# Altium schematic sheet DB10005_CAN.SchDoc: CAN interface
size A4; SheetNumber: 6; SheetTotal: 7
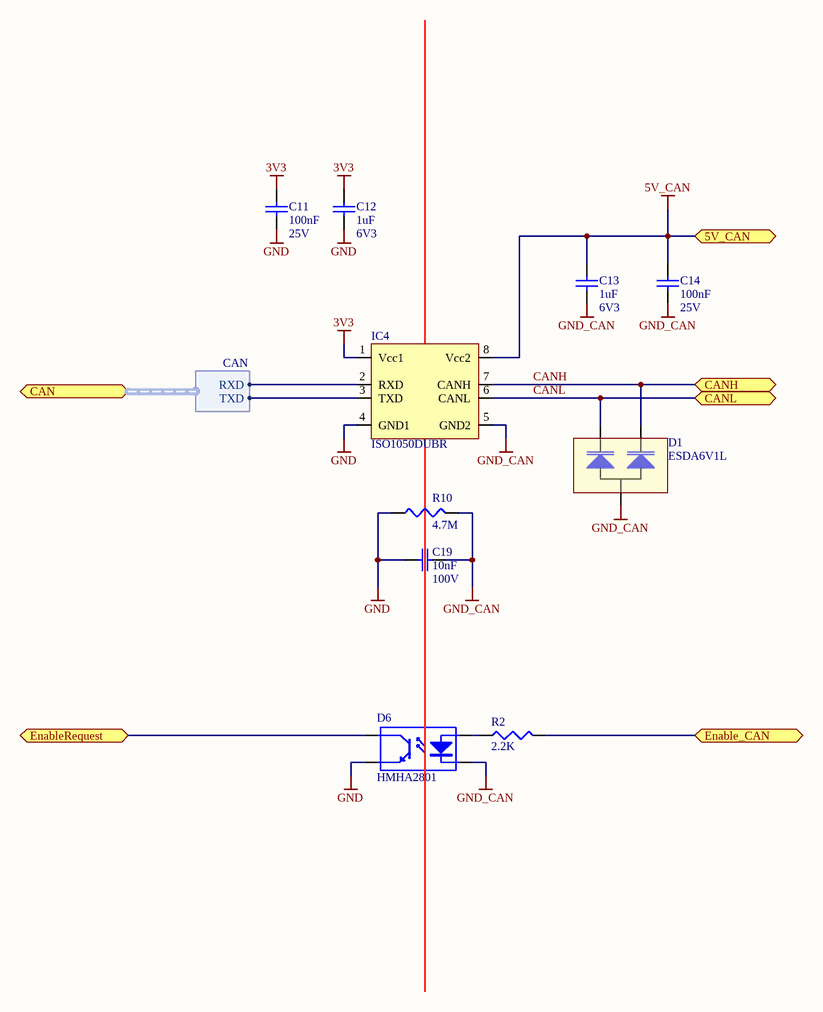
[diagram p0: DB10005_CAN.SchDoc]

## Parts
C11  100nF  Voltage Rating: 25V  [C0402]
C12  1uF  Voltage Rating: 6V3  [C0402]
C13  1uF  Voltage Rating: 6V3  [C0402]
C14  100nF  Voltage Rating: 25V  [C0402]
C19  10nF  Voltage Rating: 100V  [C-0805]
D1  ESDA6V1L  [SOT23]
D6  HMHA2801  [FSOP4]
IC4  ISO1050DUBR  [PDSO8]
R2  2.2K  [0603]
R10  4.7M  [0805]

## Ports
5V_CAN, CAN (harness CAN), CANH, CANL, Enable_CAN, EnableRequest

## Harnesses
CAN: RXD, TXD

## Nets
3V3: C11.2 C12.2 IC4.1(Vcc1)
5V_CAN: C13.2 C14.2 IC4.8(Vcc2) ; port 5V_CAN
GND: C11.1 C12.1 C19.1 D6.3(E1) IC4.4(GND1) R10.1
GND_CAN: C13.1 C14.1 C19.2 D1.A D6.2(K1) IC4.5(GND2) R10.2
CANH: D1.K1 IC4.7(CANH) ; port CANH
CANL: D1.K2 IC4.6(CANL) ; port CANL
Enable_CAN: R2.2 ; port Enable_CAN
EnableRequest: D6.4(C1) ; port EnableRequest
NetD6_1: D6.1(A1) R2.1
NetIC4_2: IC4.2(RXD) ; port CAN.RXD
NetIC4_3: IC4.3(TXD) ; port CAN.TXD

## Notes on the sheet
- Title
- Size:
- Date:
- A4
- Number:
- Time:
- Revision:
- Sheet
- of
- File:

## Library data of the parts
C11 C14 = 100nF/0402/CER/25V: Capacitor, 100nF, 25V, X7R; Capacitance Tolerance: 10nF; Capacitor Case Style: 0402; Brand Number: GRM155R71E104KE14D; Brand: MULTICOMP; Dielectric Characteristic: X7R; Capacitance: 100nF; Temperature Range: -55 to +125 C; Price: 0,0225; Order Code Supplier: 2456106; Supplier: Farnell
C12 C13 = 1uF/0402/CER/6.3V: Capacitor, 1uF, 6.3V, X5R; Capacitance Tolerance: ± 10%; Capacitor Case Style: 0402; Brand Number: 04026D105KAT2A; Brand: AVX; Dielectric Characteristic: X5R; Capacitance: 1uF; Temperature Range: -55°C to +85°C; Price: 0,0874; Order Code Supplier: 1327658; Supplier: Farnell
C19 = 10nF/0805/CER/100V: Capacitor, 10nF, 100V, X7R; Capacitance Tolerance: ± 10%; Capacitor Case Style: 0805; Brand Number: 08051C103KAZ2A; Brand: AVX; Dielectric Characteristic: X7R; Capacitance: 10nF; Temperature Range: -55°C to +125°C; Price: 0,131; Order Code Supplier: 1301898; Supplier: Farnell
D1 = ESDA6V1L: Diode TVS Dual, Vrwm: 5.25V, Vbr: 7.2V, Vc: 12.45V, Ippm: 15A; Brand: STMICROELECTRONICS; Case Style: SOT-23; Brand Number: ESDA6V1L; Breakdown Voltage: 7.2V; Clamping Voltage: 12.45V; Ippm: 15A; Order Code Supplier: 9802258; Price: 0,62; Supplier: Farnell; Temperature Range: -40°C to +125°C; Vrwm: 5.25V
D6 = HMHA2801: Optocoupler, Vout:80V, Iin:0.01A; Brand: FAIRCHILD SEMICONDUCTOR; Isolation Voltage: 2500V; Input Current: 0.01A; Output Voltage: 80V; Brand Number: HMHA2801; Case Style: *; Price: 0,28; Order Code Supplier: 1652504; Supplier: Farnell; Temperature Range: -55°C to +100°C
IC4 = ISO1050DUBR: CAN TRANSCEIVER; Brand: Texas Instruments; Case Style: SO8; Brand Number: ISO1050DUBR; Order Code Supplier: 1755712; Price: 5,44; Supplier: Farnell; Temperature Range: -55°C to +155°C
R2 = 2.2K/0603/0063W/50V: Resistor, 2.2K, 1%, 0.063W, 50V, 100PPM, 0603; Brand: VISHAY DRALORIC; Brand Number: CRCW06032K20FKEA; Case Style: 0603; Order Code Supplier: 2122405; Power Rating: 0.063W; Price: 0,038; Resistance: 2.2K; Supplier: Farnell; Temperature Coefficient: ± 100PPM; Temperature Range: -55°C to +125°C; Voltage Rating: 50V
R10 = 4.7M/0805/0250W/150V: Resistor, 4.7M, 1%, 0.25W, 150V, 100PPM, 0805; Brand: MULTICOMP; Brand Number: MCHP05W4F4704T5E; Case Style: 0805; Order Code Supplier: 1576516; Power Rating: 0.25W; Price: 0,089; Resistance: 4.7M; Supplier: Farnell; Temperature Coefficient: ± 100PPM; Temperature Range: -55°C to +155°C; Voltage Rating: 150V